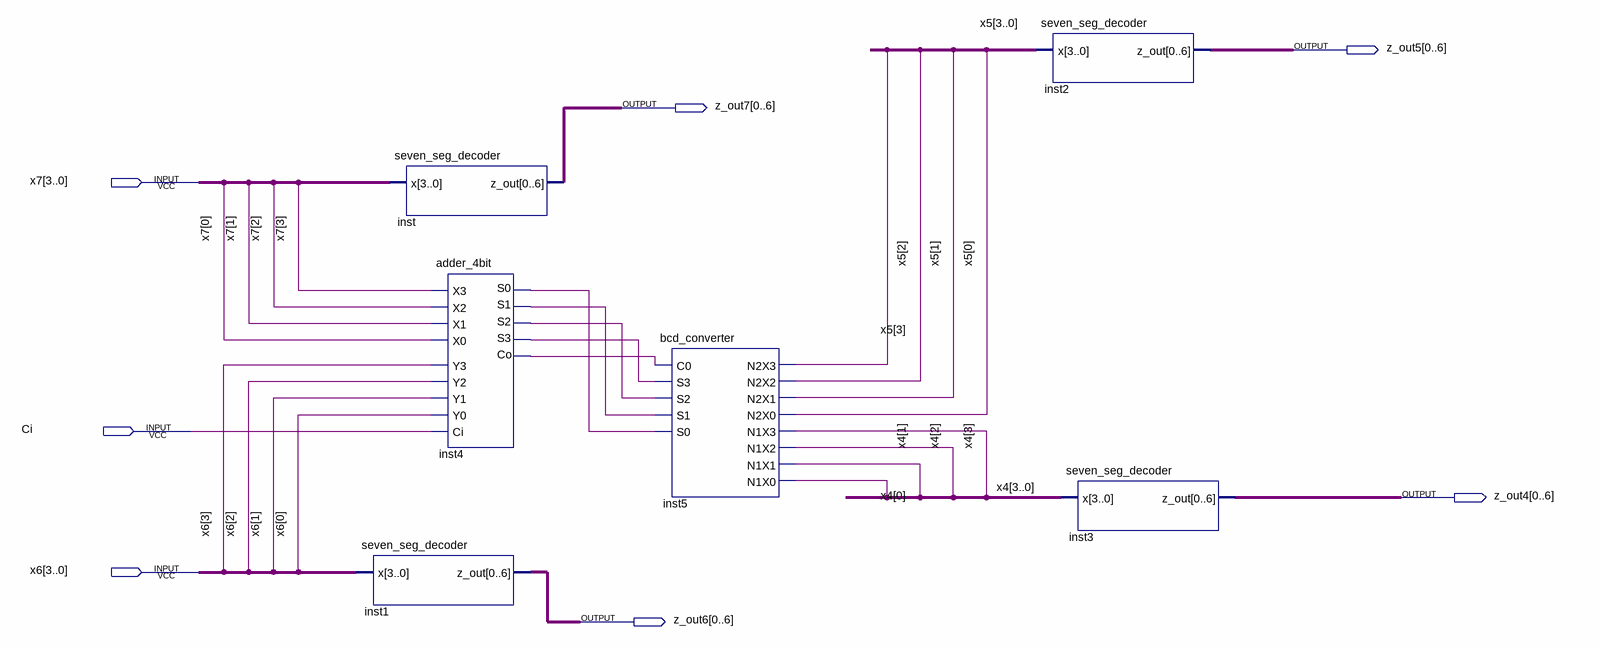
[diagram p0: schematic sheet]
// Quartus schematic 7_display_adder.bdf as structural Verilog: 6 symbols, 7 pins
module \7_display_adder  (
  input  [3:0] x7,
  input  Ci,
  input  [3:0] x6,
  output [0:6] z_out5,
  output [0:6] z_out7,
  output [0:6] z_out4,
  output [0:6] z_out6
);

  wire inst4_co, inst4_s0, inst4_s1, inst4_s2, inst4_s3;
  wire [3:0] x4, x5;

  seven_seg_decoder inst (.x(x7), .z_out(z_out7));
  seven_seg_decoder inst1 (.x(x6), .z_out(z_out6));
  adder_4bit inst4 (
    .X3(x7[3]), .Y3(x6[3]), .X2(x7[2]), .Y2(x6[2]), .X1(x7[1]), .Y1(x6[1]), .X0(x7[0]), .Y0(x6[0]), .Ci(Ci),
    .S0(inst4_s0), .S1(inst4_s1), .S2(inst4_s2), .S3(inst4_s3), .Co(inst4_co));
  bcd_converter inst5 (
    .C0(inst4_co), .S3(inst4_s3), .S2(inst4_s2), .S1(inst4_s1), .S0(inst4_s0), .N2X3(x5[3]), .N2X2(x5[2]),
    .N2X1(x5[1]), .N2X0(x5[0]), .N1X3(x4[3]), .N1X2(x4[2]), .N1X1(x4[1]), .N1X0(x4[0]));
  seven_seg_decoder inst2 (.x(x5), .z_out(z_out5));
  seven_seg_decoder inst3 (.x(x4), .z_out(z_out4));
endmodule
